# EAGLE design LCD_Display_encoder-1U (EAGLE 6.6.0)
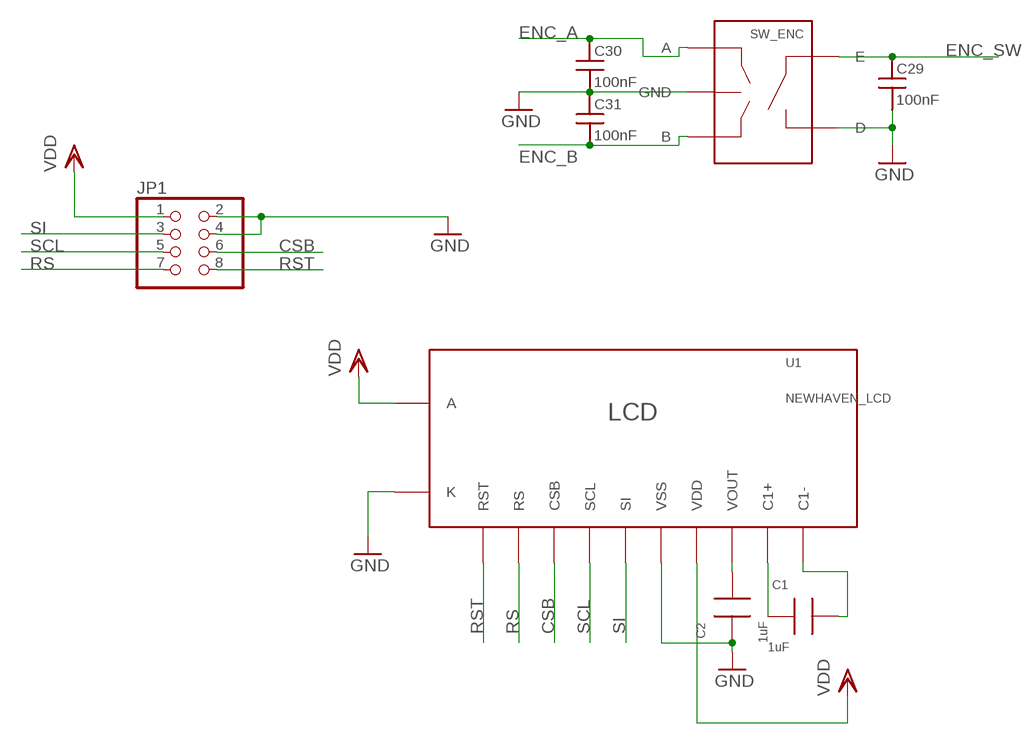
[diagram p0: schematic, sheet 1]

## Parts
C1  1uF  CAP0805  [0805]
C2  1uF  CAP0805  [0805]
C29  100nF  C_MLCC_SMDCMLCC_0603  [C_MLCC_0603]
C30  100nF  C_MLCC_SMDCMLCC_0603  [C_MLCC_0603]
C31  100nF  C_MLCC_SMDCMLCC_0603  [C_MLCC_0603]
JP1  PINHD-2X4SMT  [2X4SMT]
SW_ENC  ROTARY_PEC11R  [PEC11R]
U1  NEWHAVEN_LCD  [NEWHAVEN_LCD]

## Nets
CSB: JP1.6 U1.3(CSB)
ENC_A: C30.P$1 SW_ENC.A
ENC_B: C31.P$2 SW_ENC.B
ENC_SW: C29.P$1 SW_ENC.2(E)
GND: C2.1 C29.P$2 C30.P$2 C31.P$1 JP1.2 JP1.4 SW_ENC.1(D) SW_ENC.C(GND) U1.6(VSS) U1.K
N$1: C1.1 U1.9(C1+)
N$2: C1.2 U1.10(C1-)
N$3: C2.2 U1.8(VOUT)
RS: JP1.7 U1.2(RS)
RST: JP1.8 U1.1(RST)
SCL: JP1.5 U1.4(SCL)
SI: JP1.3 U1.5(SI)
VDD: JP1.1 U1.7(VDD) U1.A

## Library data of the parts
C1 C2 = rlc-jqi:CAP: SMT Capacitor; PARTNO: 1276-2396-1-ND
C29-C31 = jqi_passives:C_MLCC_SMD; PARTNO: 1276-1936-1-ND
JP1 = mcu-accessories:PINHD-2X4: PIN HEADER
SW_ENC = aom_driver:ROTARY_PEC11R: PEC11R Rotary encoder. Digikey PEC11R-4120F-S0018-ND; PARTNO: PEC11R-4120F-S0018-ND
U1 = mcu-accessories:NEWHAVEN_LCD: 2x16 char LCD, Newhaven PN NHD-C0216CZ-FSW-FBW-3V3 or similar.; PARTNUM: NHD-C0216CZ-FSW-FBW-3V3-ND

## Board
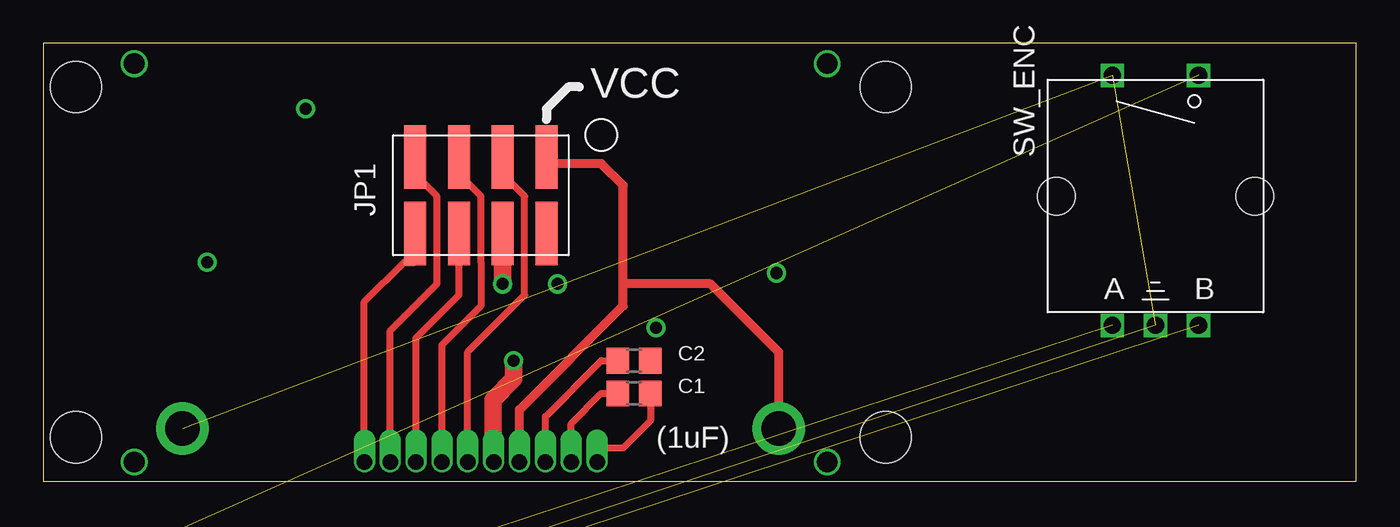
[diagram p1: board, top side]
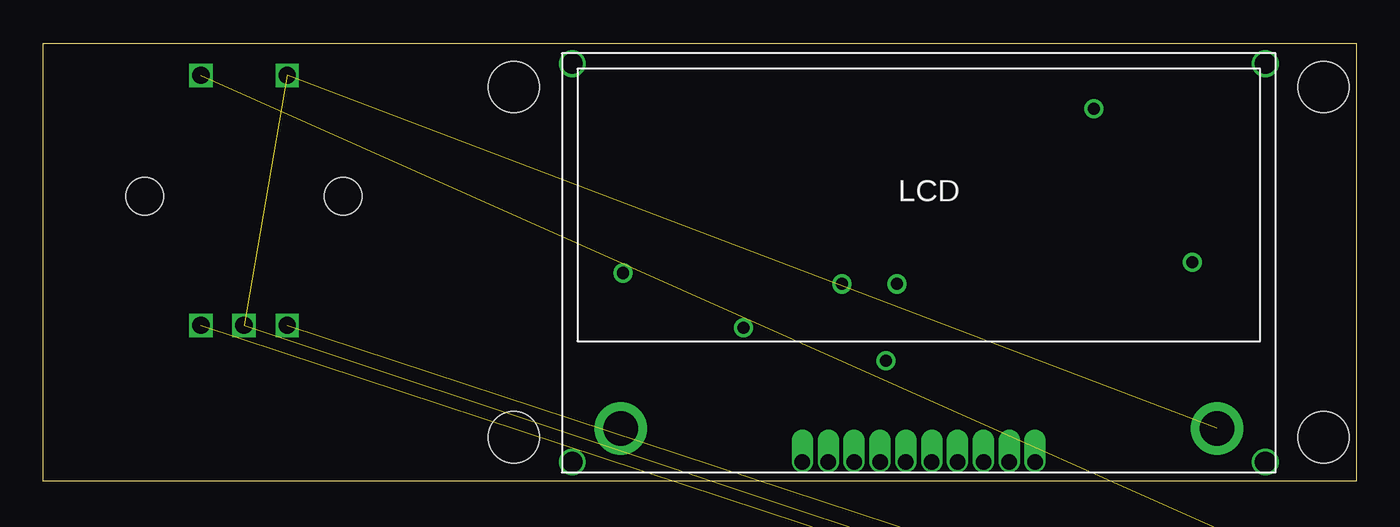
[diagram p2: board, bottom side, seen from below]

Size 76.2 x 25.4 mm. Coordinates in mm from the lower left corner, seen from the top.
Outline: 0,0 76.2,0 76.2,25.4 0,25.4 0,0
Copper layers (1*16): Top 0.035mm / dielectric 1.5mm / Bottom 0.035mm
Design rules "default *": minimum track width 10mil, minimum drill 24mil, track to track 8mil, track to pad 8mil, pad to pad 8mil, via to via 8mil, smd to smd 8mil, copper to edge 15mil, drill to drill 8mil, minimum pad ring 7mil, minimum via ring 8mil, stop-mask expansion 4mil, vias tented up to drill 0mil, thermal gap 10mil
Holes 2.95 mm at 1.91,22.86 1.91,2.54 48.9,22.86 48.9,2.54

### Footprints (pad centres in the part's own frame; a part is rotated, then mirrored left to right if it is on the bottom)
0805 = smd 1.3 x 1.5: 1 -0.95,0; 2 0.95,0
C_MLCC_0603 = smd 0.8 x 0.8: P$1 -0.75,0; P$2 0.75,0
2X4SMT = smd 1.27 x 3.683: 1 -3.81,-2.286; 2 -3.81,2.159; 3 -1.27,-2.286; 4 -1.27,2.159; 5 1.27,-2.286; 6 1.27,2.159; 7 3.81,-2.286; 8 3.81,2.159
PEC11R = drill 1 square: 1 3.75,13.75; 2 8.75,13.75; A 3.75,-0.75; B 8.75,-0.75; C 6.25,-0.75 | hole 2.159: 0.5,6.75; 12,6.75
NEWHAVEN_LCD = drill 0.9 pad 1.2 offset: 1 27.45,0.6; 2 25.95,0.6; 3 24.45,0.6; 4 22.95,0.6; 5 21.45,0.6; 6 19.95,0.6; 7 18.45,0.6; 8 16.95,0.6; 9 15.45,0.6; 10 13.95,0.6 | drill 2 pad 3.048: A 3.4,2.55; K 38,2.55 | drill 1.2: MOUNT$1 0.6,0.6; MOUNT$2 40.8,0.6; MOUNT$3 40.8,23.7; MOUNT$4 0.6,23.7

### Placement (x,y rotation side)
C1  34.29,5.08 0 top
C2  34.29,6.99 180 top
C29  -31.93,-20.9 0 top  (outside the outline)
C30  -28.27,-20.9 0 top  (outside the outline)
C31  -24.61,-20.9 0 top  (outside the outline)
JP1  25.4,16.51 180 top
SW_ENC  58.29,9.78 0 top
U1  46.09,0.51 0 bottom

### Tracks (layer width: path | path; a pad name or v marks a point on that pad's centre or on a via)
CSB
  Top 0.406: U1.3 21.64,8.31 24.13,10.79 JP1.6
ENC_A  (1 unrouted)
ENC_B  (1 unrouted)
ENC_SW  (1 unrouted)
GND  (via drill 0.7)  (5 unrouted)
  Top 1.016: JP1.4 v26.67,11.43 | v27.3,6.99 27.3,5.92 26.11,4.72 26.11,1.63 26.16,1.57
  other vias: 29.84,11.43 35.56,8.89 42.55,12.06 9.53,12.7 15.24,21.59
N$1
  Top 0.406: U1.9 30.64,3.34 32.38,5.08 C1.1 33.02,5.08
N$2
  Top 0.406: C1.2 35.24,3.49 33.66,1.91 32.38,1.91 32.38,1.35 U1.10
N$3
  Top 0.406: U1.8 29.14,3.74 32.38,6.99 C2.2
RS
  Top 0.406: JP1.7 21.59,17.78 22.86,16.51 22.86,11.43 20.14,8.71 U1.2
RST
  Top 0.406: U1.1 18.64,10.39 20.95,12.7 21.59,12.7 JP1.8
SCL
  Top 0.406: JP1.5 24.13,17.78 25.4,16.51 25.4,12.7 25.4,10.16 23.14,7.9 U1.4
SI
  Top 0.406: JP1.3 26.67,17.78 27.94,16.51 27.94,10.79 24.64,7.5 U1.5
VDD
  Top 0.508: U1.7 27.64,4.15 33.66,10.16 33.66,11.43 | 33.66,11.43 33.66,17.14 32.38,18.41 29.59,18.41 JP1.1 | U1.A 42.69,7.47 38.73,11.43 33.66,11.43

### Text on the board
tPlace: VCC | (1uF)